# EAGLE schematic sensor (EAGLE 6.3)
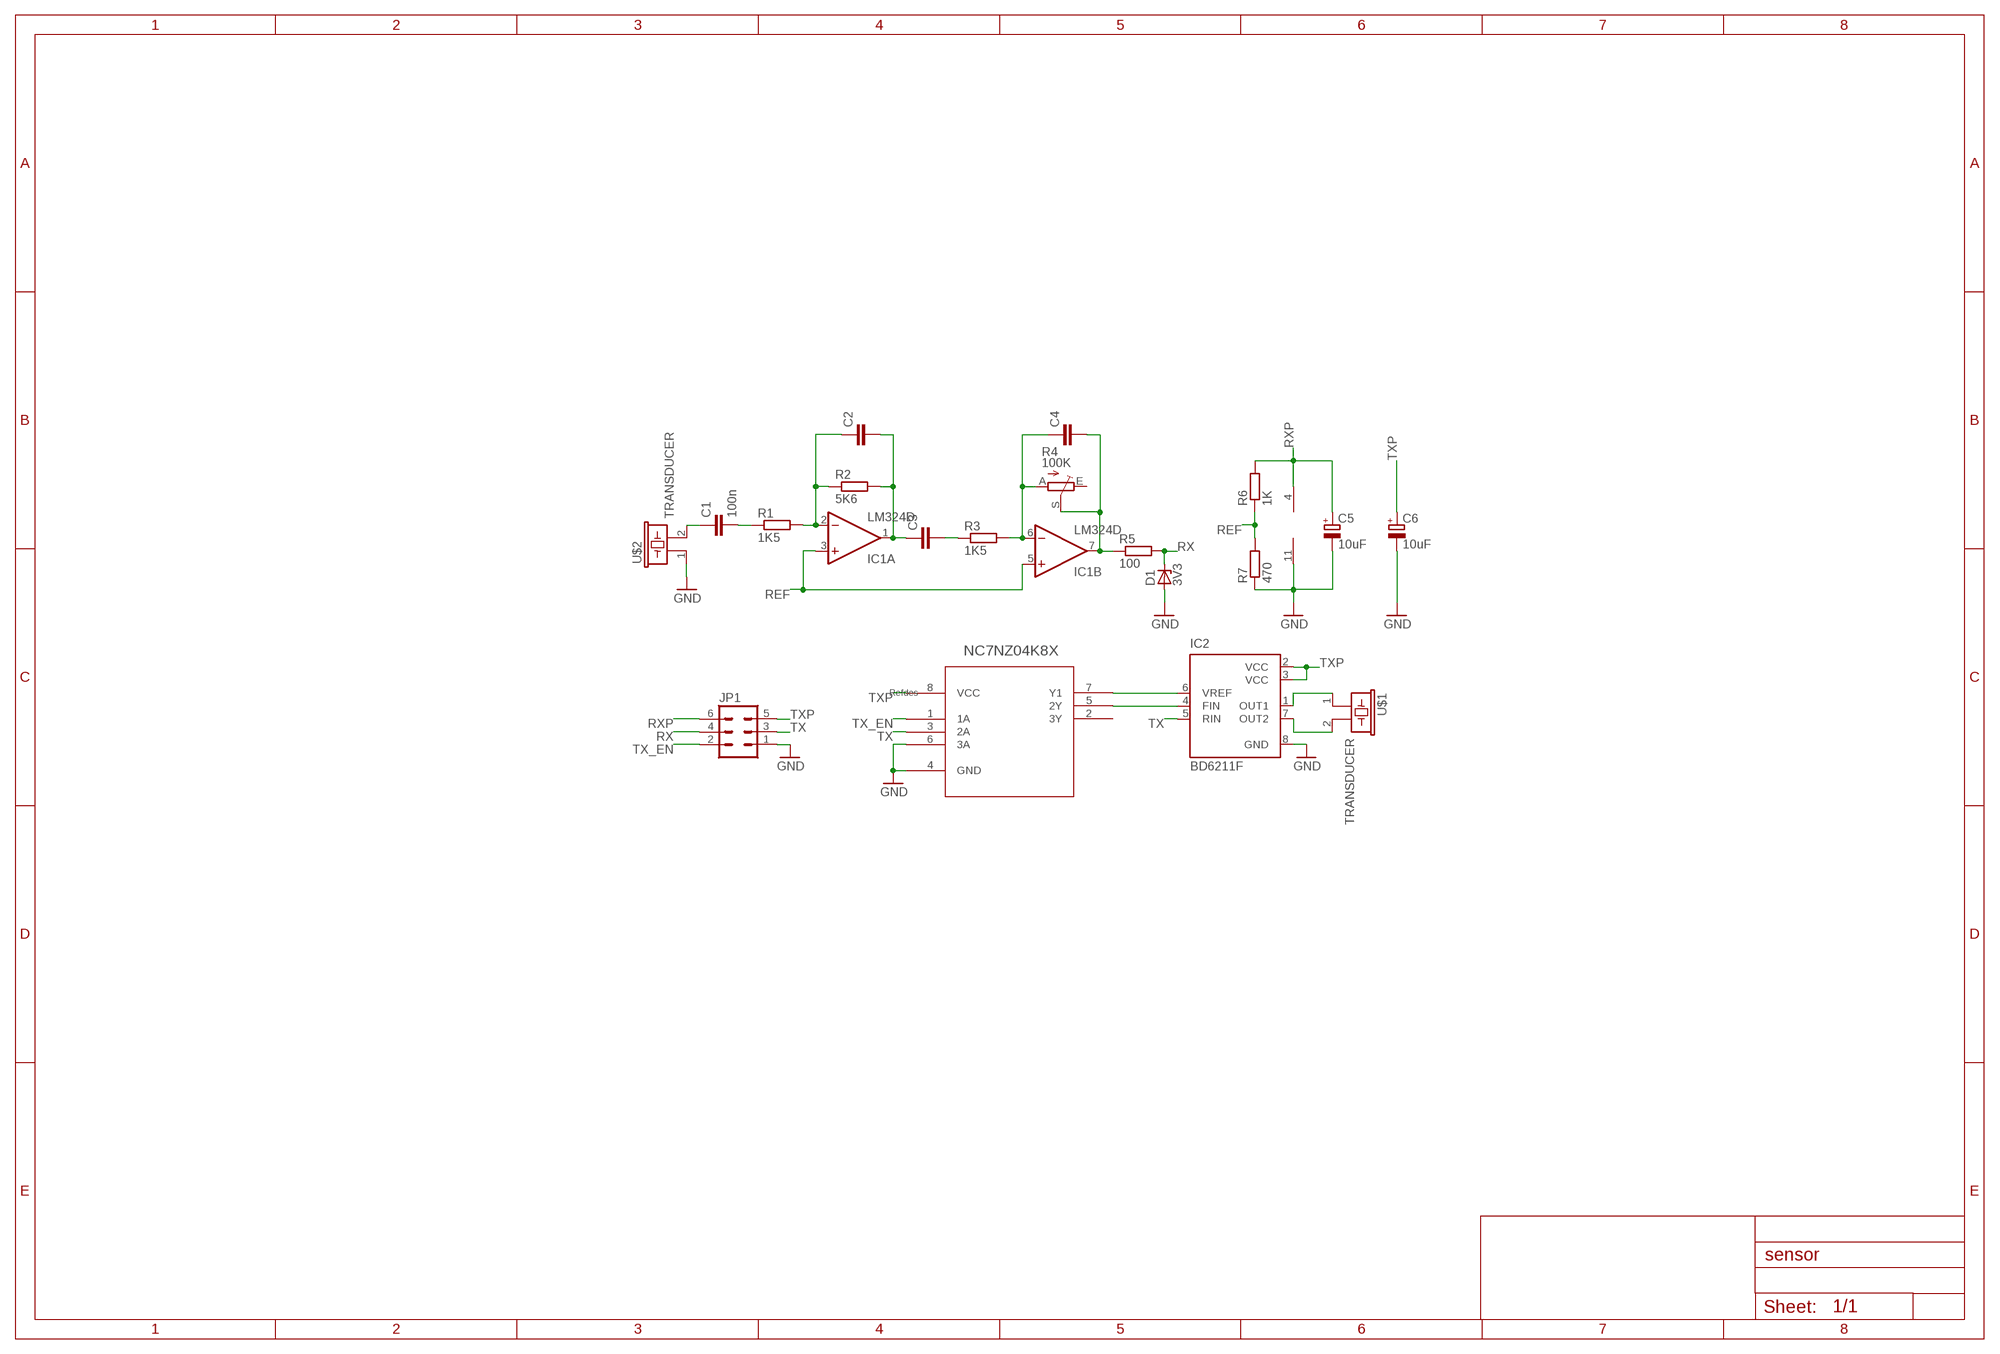
[diagram p0: schematic, sheet 1]

## Parts
C1  100n  C-EUC0805  [C0805]
C2  C-EUC0805  [C0805]
C3  C-EUC0805  [C0805]
C4  C-EUC0805  [C0805]
C5  10uF  CPOL-EUE2-5  [E2-5]
C6  10uF  CPOL-EUE2-5  [E2-5]
D1  3V3  ZENER-DIODEZD-2.5  [ZDIO-2.5]
IC1  LM324D  [SO14]
IC2  BD6211F  [SOP8]
JP1  MA03-2  [MA03-2]
R1  1K5  R-EU_R0805  [R0805]
R2  5K6  R-EU_R0805  [R0805]
R3  1K5  R-EU_R0805  [R0805]
R4  100K  TRIM_EU-S63P  [S63P]
R5  100  R-EU_R0805  [R0805]
R6  1K  R-EU_R0805  [R0805]
R7  470  R-EU_R0805  [R0805]
U1  NC7NZ04K8X  [SOP50P310X90-8N]
U$1  TRANSDUCER  [TRANSDUCER]
U$2  TRANSDUCER  [TRANSDUCER]

## Nets
GND: C5.- C6.- D1.A IC1.11(P:V-) IC2.8(GND) JP1.1 R7.1 U1.4(GND) U1.6(3A) U$2.1
N$1: C2.1 IC1.2(A:-IN) R1.2 R2.1
N$2: C1.2 R1.1
N$3: C2.2 C3.1 IC1.1(A:OUT) R2.2
N$5: C3.2 R3.1
N$6: C4.1 IC1.6(B:-IN) R3.2 R4.A
N$7: C4.2 IC1.7(B:OUT) R4.S R5.1
N$9: C1.1 U$2.2
N$10: IC2.1(OUT1) U$1.1
N$11: IC2.7(OUT2) U$1.2
N$12: IC2.6(VREF) U1.7(Y1)
N$13: IC2.4(FIN) U1.5(2Y)
REF: IC1.3(A:+IN) IC1.5(B:+IN) R6.1 R7.2
RX: D1.C JP1.4 R5.2
RXP: C5.+ IC1.4(P:V+) JP1.6 R6.2
TX: IC2.5(RIN) JP1.3 U1.3(2A)
TX_EN: JP1.2 U1.1(1A)
TXP: C6.+ IC2.2(VCC) IC2.3(VCC) JP1.5 U1.8(VCC)
Unconnected: IC1.8(C:OUT) IC1.9(C:-IN) IC1.10(C:+IN) IC1.12(D:+IN) IC1.13(D:-IN) IC1.14(D:OUT) R4.E U1.2(3Y)

## Library data of the parts
C1-C4 = rcl:C-EU: CAPACITOR, European symbol
C5 C6 = rcl:CPOL-EU: POLARIZED CAPACITOR, European symbol
D1 = diode:ZENER-DIODE: Z-Diode
IC1 = linear:LM324: OP AMP; OC_FARNELL: 1426353
IC2 = Ultrasound:BD6211F; OC_FARNELL: 1716259
JP1 = con-lstb:MA03-2: PIN HEADER; OC_FARNELL: unknown; OC_NEWARK: unknown
R1-R3 R5-R7 = rcl:R-EU_: RESISTOR, European symbol
R4 = pot:TRIM_EU-: POTENTIOMETER
U1 = Ultrasound:NC7NZ04K8X: UHS Inverter; MPN: NC7NZ04K8X; OC_FARNELL: 1417663; OC_NEWARK: 33K4450; PACKAGE: SO-8; SUPPLIER: FAIRCHILD SEMICONDUCTOR
U$1 U$2 = Ultrasound:TRANSDUCER